# EAGLE design RevA (EAGLE 7.3.0)
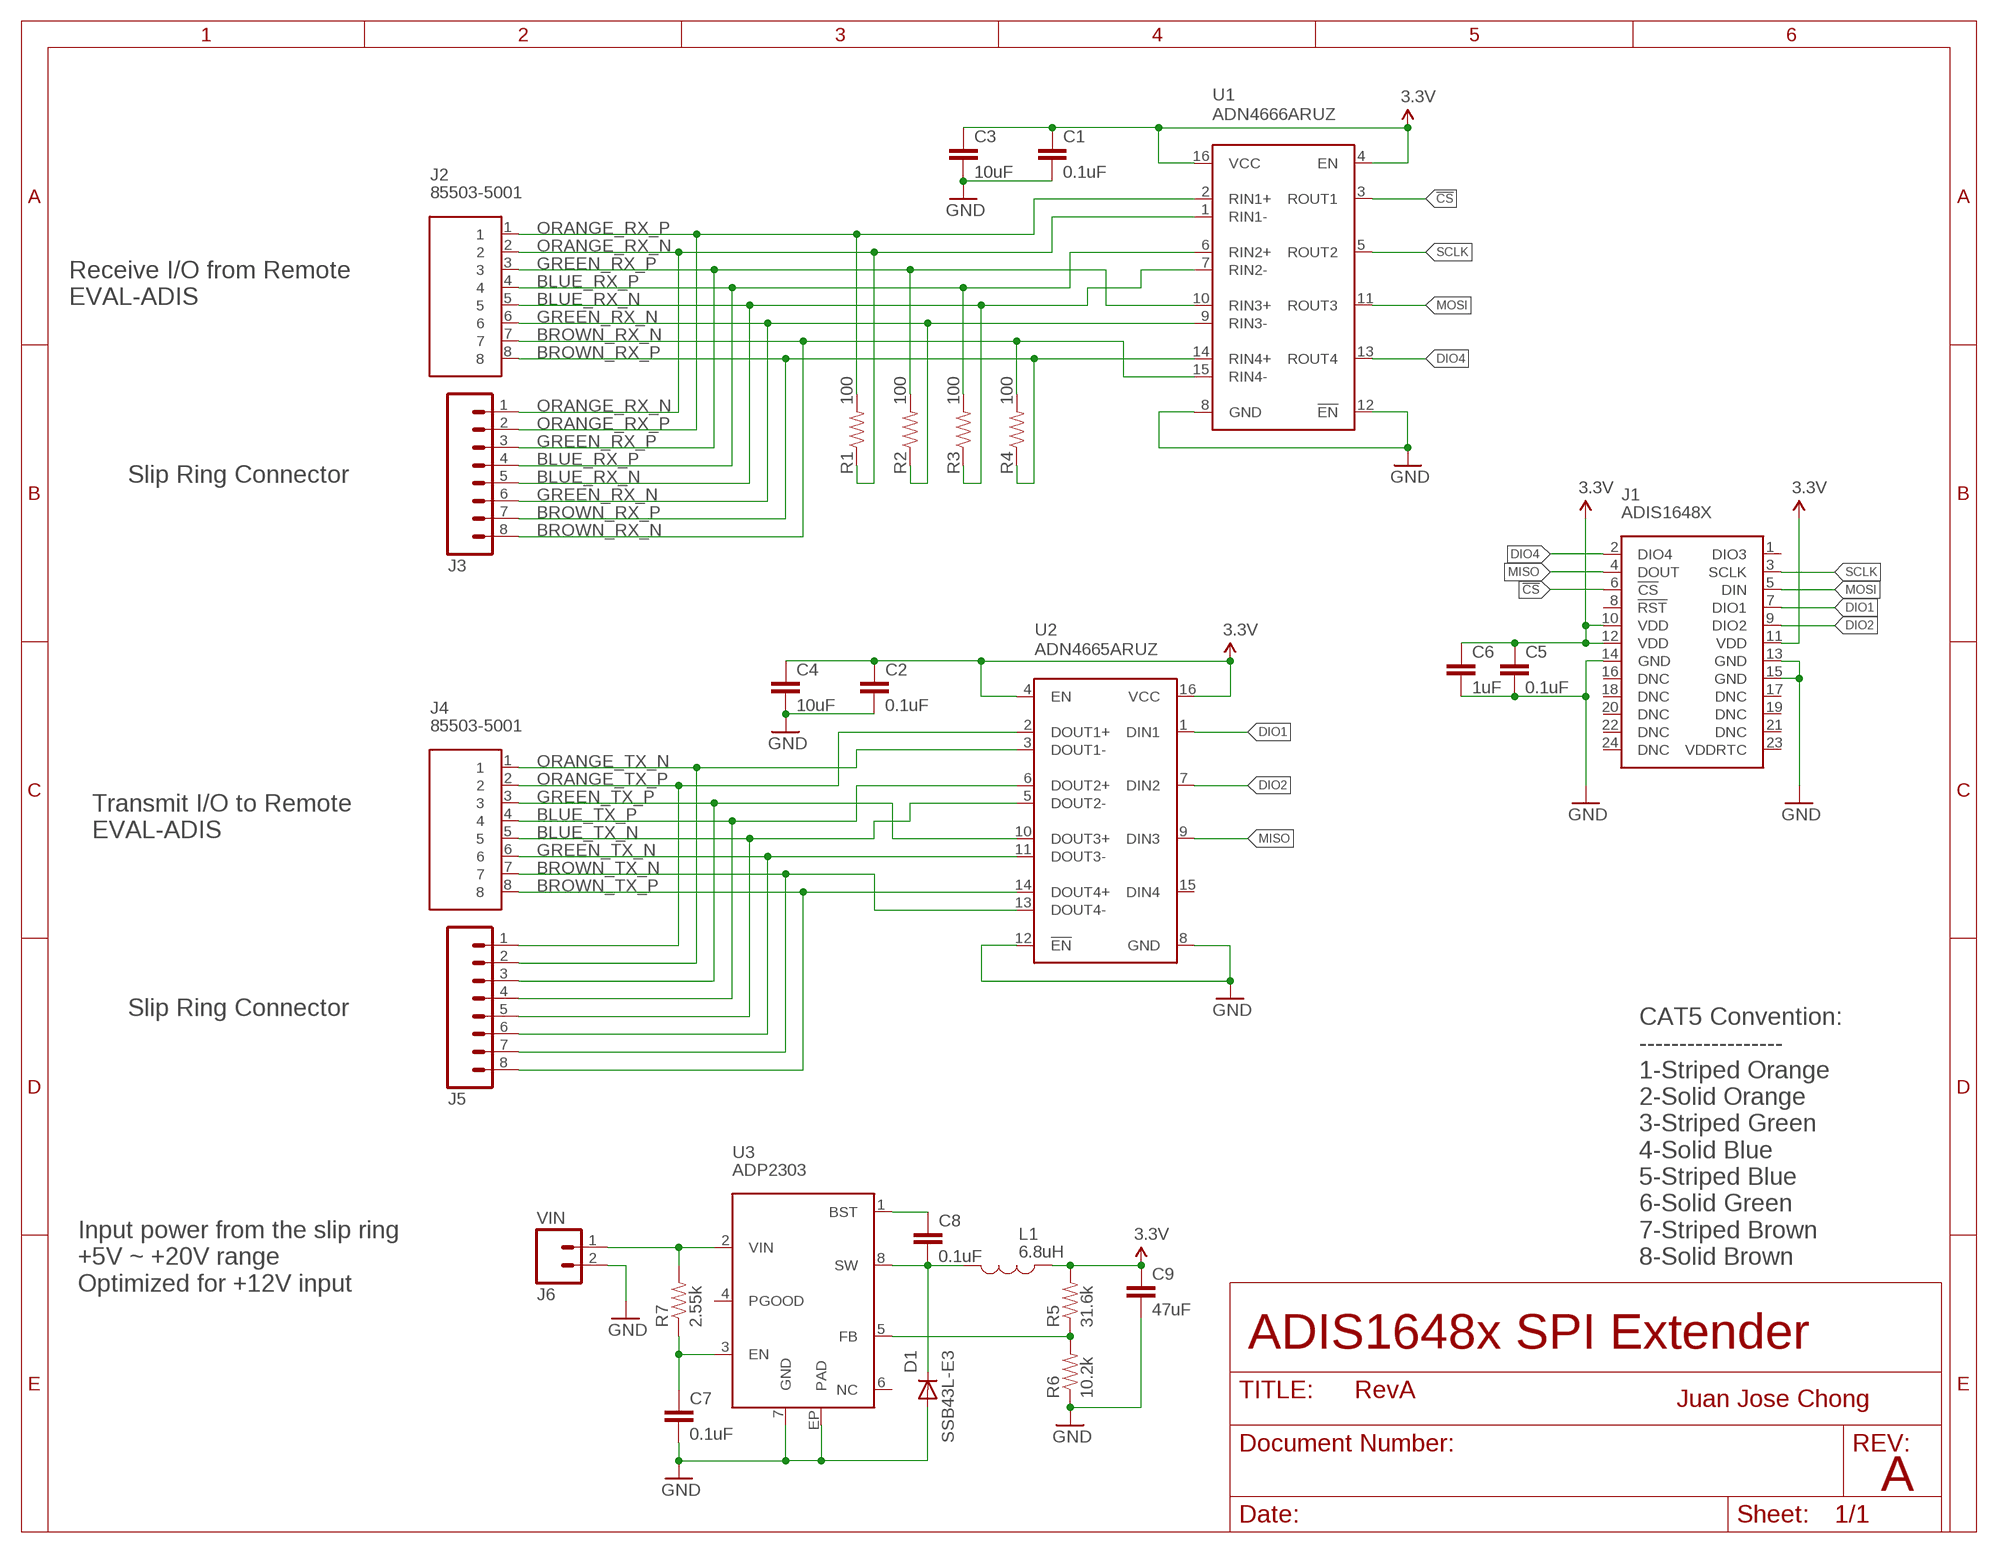
[diagram p0: schematic, sheet 1]

## Parts
C1  0.1uF  CAP0603-CAP  [0603-CAP]
C2  0.1uF  CAP0603-CAP  [0603-CAP]
C3  10uF  CAP1206  [1206]
C4  10uF  CAP1206  [1206]
C5  0.1uF  CAP0603-CAP  [0603-CAP]
C6  1uF  CAP0603-CAP  [0603-CAP]
C7  0.1uF  CAP0603-CAP  [0603-CAP]
C8  0.1uF  CAP0603-CAP  [0603-CAP]
C9  47uF  CAP1206  [1206]
D1  SSB43L-E3  DIODE-DO214AA  [DO214AA]
J1  ADIS1648X  [ADIS1648X]
J2  85503-5001  [85503-5001]
J3  M08LOCK  [1X08_LOCK]
J4  85503-5001  [85503-5001]
J5  M08LOCK  [1X08_LOCK]
J6  VIN  M023.5MM  [SCREWTERMINAL-3.5MM-2]
L1  6.8uH  INDUCTOR  [VLF10040]
R1  100  RESISTOR0603-RES  [0603-RES]
R2  100  RESISTOR0603-RES  [0603-RES]
R3  100  RESISTOR0603-RES  [0603-RES]
R4  100  RESISTOR0603-RES  [0603-RES]
R5  31.6k  RESISTOR0603-RES  [0603-RES]
R6  10.2k  RESISTOR0603-RES  [0603-RES]
R7  2.55k  RESISTOR0603-RES  [0603-RES]
U1  ADN4666ARUZ  [TSSOP-16]
U2  ADN4665ARUZ  [TSSOP-16]
U3  ADP2303  [SOIC-8-PAD]

## Nets
3.3V: C1.1 C2.1 C3.1 C4.1 C5.1 C6.1 C9.1 J1.10(VDD) J1.11(VDD) J1.12(VDD) L1.P$1 R5.2 U1.4(EN) U1.16(VCC) U2.4(EN) U2.16(VCC)
!CS: J1.6(!CS) U1.3(ROUT1)
BLUE_RX_N: J2.5 J3.5 R3.1 U1.7(RIN2-)
BLUE_RX_P: J2.4 J3.4 R3.2 U1.6(RIN2+)
BLUE_TX_N: J4.5 J5.5 U2.5(DOUT2-)
BLUE_TX_P: J4.4 J5.4 U2.6(DOUT2+)
BROWN_RX_N: J2.7 J3.8 R4.2 U1.15(RIN4-)
BROWN_RX_P: J2.8 J3.7 R4.1 U1.14(RIN4+)
BROWN_TX_N: J4.7 J5.7 U2.13(DOUT4-)
BROWN_TX_P: J4.8 J5.8 U2.14(DOUT4+)
DIO1: J1.7(DIO1) U2.1(DIN1)
DIO2: J1.9(DIO2) U2.7(DIN2)
DIO4: J1.2(DIO4) U1.13(ROUT4)
GND: C1.2 C2.2 C3.2 C4.2 C5.2 C6.2 C7.2 C9.2 D1.A J1.13(GND) J1.14(GND) J1.15(GND) J6.2 R6.1 U1.8(GND) U1.12(!EN) U2.8(GND) U2.12(!EN) U3.7(GND) U3.EP(PAD)
GREEN_RX_N: J2.6 J3.6 R2.1 U1.9(RIN3-)
GREEN_RX_P: J2.3 J3.3 R2.2 U1.10(RIN3+)
GREEN_TX_N: J4.6 J5.6 U2.11(DOUT3-)
GREEN_TX_P: J4.3 J5.3 U2.10(DOUT3+)
MISO: J1.4(DOUT) U2.9(DIN3)
MOSI: J1.5(DIN) U1.11(ROUT3)
N$1: J6.1 R7.2 U3.2(VIN)
N$2: R5.1 R6.2 U3.5(FB)
N$3: C8.2 D1.C L1.P$2 U3.8(SW)
N$4: C8.1 U3.1(BST)
N$5: C7.1 R7.1 U3.3(EN)
ORANGE_RX_N: J2.2 J3.1 R1.1 U1.1(RIN1-)
ORANGE_RX_P: J2.1 J3.2 R1.2 U1.2(RIN1+)
ORANGE_TX_N: J4.1 J5.2 U2.3(DOUT1-)
ORANGE_TX_P: J4.2 J5.1 U2.2(DOUT1+)
SCLK: J1.3(SCLK) U1.5(ROUT2)
Unconnected: J1.1(DIO3) J1.8(!RST) J1.16(DNC) J1.17(DNC) J1.18(DNC) J1.19(DNC) J1.20(DNC) J1.21(DNC) J1.22(DNC) J1.23(VDDRTC) J1.24(DNC) U2.15(DIN4) U3.4(PGOOD) U3.6(NC)

## Notes on the sheet
- Receive I/O from Remote
  EVAL-ADIS
- Slip Ring Connector
- Transmit I/O to Remote
  EVAL-ADIS
- Slip Ring Connector
- CAT5 Convention:
  ------------------
  1-Striped Orange
  2-Solid Orange
  3-Striped Green
  4-Solid Blue
  5-Striped Blue
  6-Solid Green
  7-Striped Brown
  8-Solid Brown
- Input power from the slip ring
  +5V ~ +20V range
  Optimized for +12V input
- ADIS1648x SPI Extender
- Juan Jose Chong
- A

## Library data of the parts
C1 C2 C5 C7 C8 = SparkFun-Passives:CAP: Capacitor Standard 0603 ceramic capacitor, and 0.1" leaded capacitor.; PARTNO: CL10B104KB8NNNC
C3 C4 = SparkFun-Passives:CAP: Capacitor Standard 0603 ceramic capacitor, and 0.1" leaded capacitor.; PARTNO: F931C106MAA
C6 = SparkFun-Passives:CAP: Capacitor Standard 0603 ceramic capacitor, and 0.1" leaded capacitor.; PARTNO: GRM188R61C105KA93D
C9 = SparkFun-Passives:CAP: Capacitor Standard 0603 ceramic capacitor, and 0.1" leaded capacitor.; PARTNO: TLJA476M010R0600
D1 = Chong:DIODE-: DIODE; PARTNO: SSB43L-E3/52T
J1 = Analog Devices iSensors:ADIS1648X
J2 J4 = AnalogDevices:85503-5001; PARTNO: 855035001
J3 J5 = SparkFun-Connectors:M08: Header 8 Standard 8-pin 0.1" header. Use with straight break away headers (SKU : PRT-00116), right angle break away headers (PRT-00553), swiss pins (PRT-00743), machine pins (PRT-00117), and female headers (PRT-00115).
J6 = SparkFun-Connectors:M02: Standard 2-pin 0.1" header. Use with - straight break away headers ( PRT-00116) - right angle break away headers (PRT-00553) - swiss pins (PRT-00743) - machine pins (PRT-00117) - female headers (PRT-00115) Molex polarized connector foot print use with: PRT-08233 with associated crimp pins and housings. 2.54_SCREWTERM for use with PRT-10571. 3.5mm Screw Terminal footprints for PRT-08084 5mm Screw Terminal footprints for use with PRT-08432
L1 = Chong:INDUCTOR: Inductors Basic Inductor/Choke - 0603 and 1206. Footprints are not proven and vary greatly between part numbers. SRN6045- 33uH, 20% 1.4A SDR0403-560KL - 56uH, 10%, 500mA RMS/740mA peak; PARTNO: VLF10040T-6R8N4R5
R1-R4 = SparkFun-Passives:RESISTOR: Resistor Basic schematic elements and footprints for 0603, 1206, and PTH resistors.; PARTNO: ERJ-3EKF1000V
R5 = SparkFun-Passives:RESISTOR: Resistor Basic schematic elements and footprints for 0603, 1206, and PTH resistors.; PARTNO: ERJ-3EKF3162V
R6 = SparkFun-Passives:RESISTOR: Resistor Basic schematic elements and footprints for 0603, 1206, and PTH resistors.; PARTNO: ERJ-3EKF1022V
R7 = SparkFun-Passives:RESISTOR: Resistor Basic schematic elements and footprints for 0603, 1206, and PTH resistors.
U1 = Analog Devices iSensors:ADN4666; PARTNO: ADN4666ARUZ
U2 = Analog Devices iSensors:ADN4665; PARTNO: ADN4665ARUZ
U3 = AnalogDevices:ADP2303; PARTNO: ADP2303ARDZ

## Board
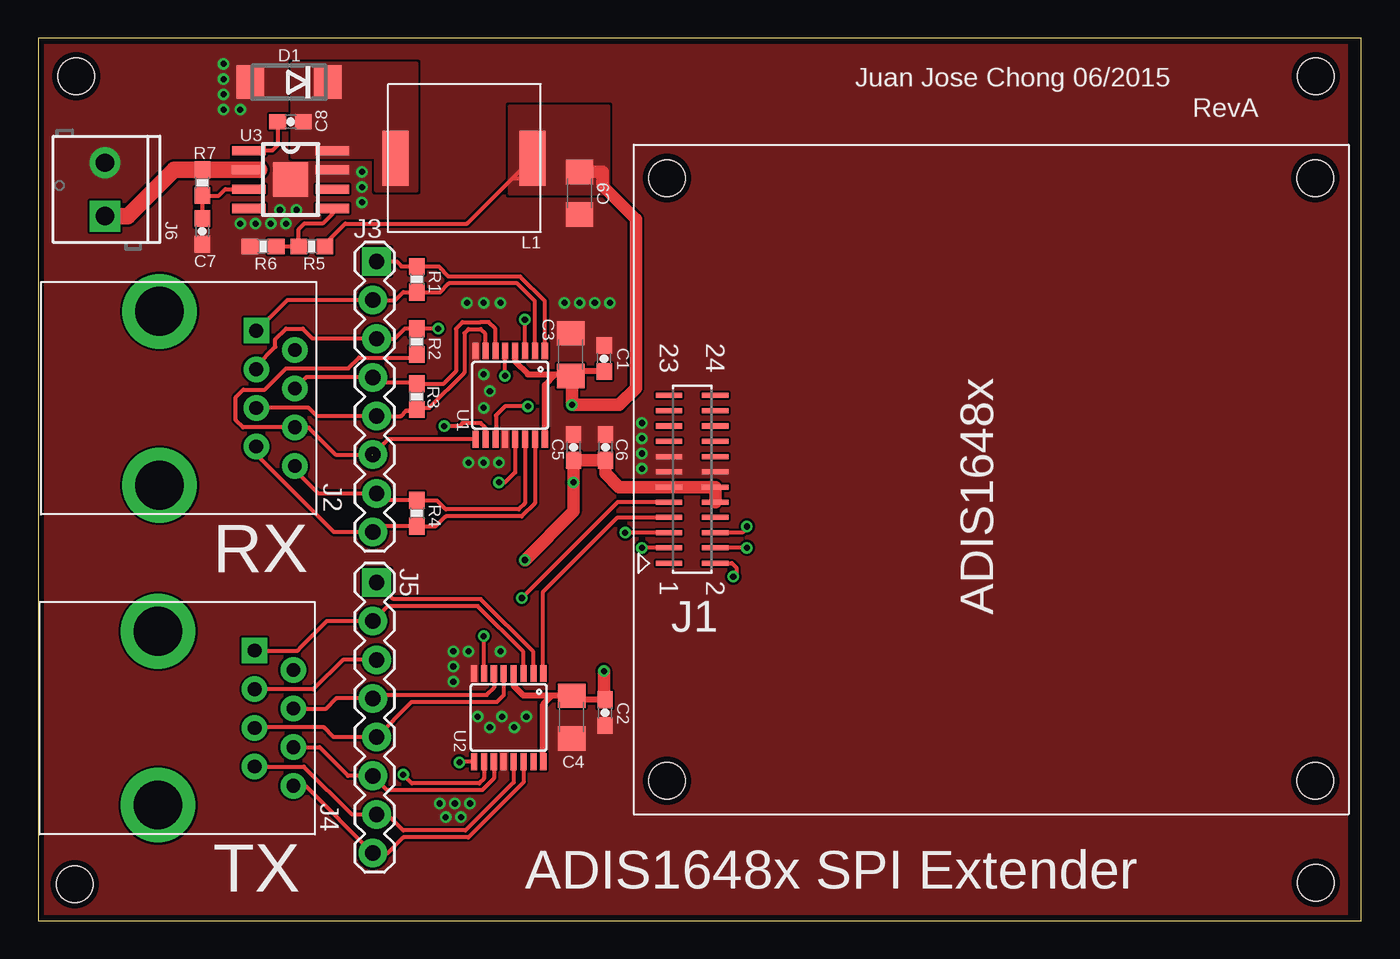
[diagram p1: board, top side]
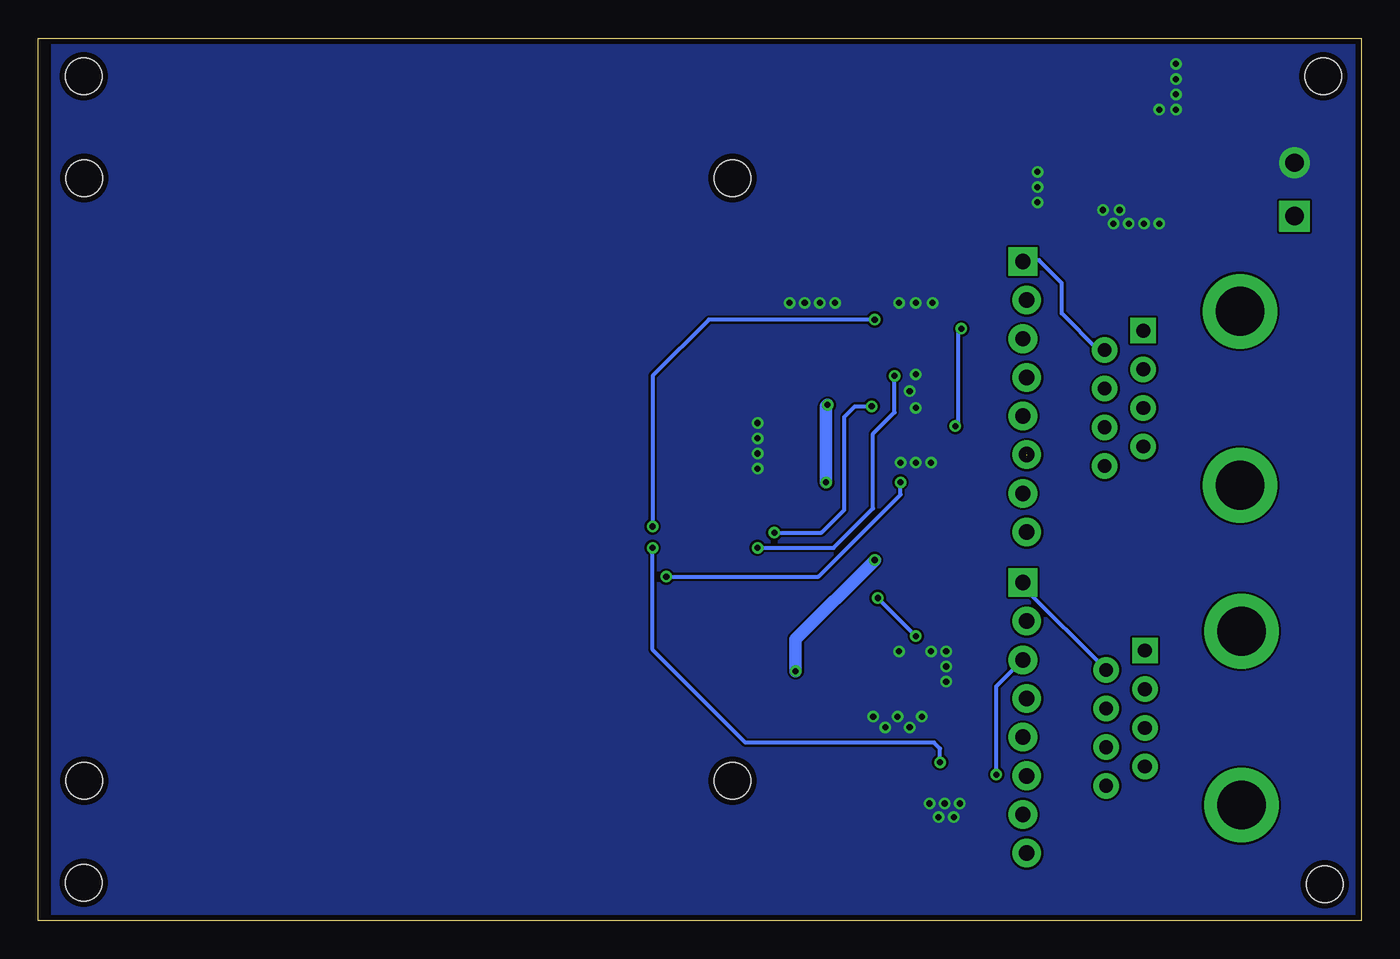
[diagram p2: board, bottom side, seen from below]

Size 87 x 58 mm. Coordinates in mm from the lower left corner, seen from the top.
Outline: 0,0 87,0 87,58 0,58 0,0
Copper layers (1*16): Top 0.0356mm / dielectric 1.5011mm / Bottom 0.0356mm
Design rules "LaenPCBOrder": minimum track width 6mil, minimum drill 13mil, track to track 6mil, track to pad 6mil, pad to pad 6mil, via to via 6mil, smd to smd 6mil, copper to edge 15mil, drill to drill 6mil, minimum pad ring 7mil, minimum via ring 7mil, stop-mask expansion 4mil, vias tented up to drill 0mil, thermal gap 10mil
Holes 2.4 mm at 2.5,55.5 2.4,2.4 84,2.5 84,55.5

### Footprints (pad centres in the part's own frame; a part is rotated, then mirrored left to right if it is on the bottom)
0603-CAP = smd 1.1 x 1: 1 -0.85,0; 2 0.85,0
1206 = smd 1.6 x 1.8: 1 -1.4,0; 2 1.4,0
DO214AA = smd 1.8 x 2.2: A 2.55,0; C -2.55,0
ADIS1648X = smd 0.33 x 1.727: 1 5.512,-1.524; 2 5.512,1.524; 3 4.496,-1.524; 4 4.496,1.524; 5 3.505,-1.524; 6 3.505,1.524; 7 2.489,-1.524; 8 2.489,1.524; 9 1.499,-1.524; 10 1.499,1.524; 11 0.508,-1.524; 12 0.508,1.524; 13 -0.508,-1.524; 14 -0.508,1.524; 15 -1.499,-1.524; 16 -1.499,1.524; 17 -2.489,-1.524; 18 -2.489,1.524; 19 -3.505,-1.524; 20 -3.505,1.524; 21 -4.496,-1.524; 22 -4.496,1.524; 23 -5.512,-1.524; 24 -5.512,1.524 | hole 2.4: -19.8,-1.642; 19.8,-1.642; 19.8,40.958; -19.8,40.958
85503-5001 = drill 0.9 pad 1.676 square: 1 0,0 | drill 0.9 pad 1.676: 2 1.27,2.54; 3 2.54,0; 4 3.81,2.54; 5 5.08,0; 6 6.35,2.54; 7 7.62,0; 8 8.89,2.54 | drill 3.2 pad 4.9: P$1 -1.27,-6.35; P$2 10.16,-6.35
1X08_LOCK = drill 1.016 pad 1.88 square: 1 0,0.127 | drill 1.016 pad 1.88: 2 2.54,-0.127; 3 5.08,0.127; 4 7.62,-0.127; 5 10.16,0.127; 6 12.7,-0.127; 7 15.24,0.127; 8 17.78,-0.127
SCREWTERMINAL-3.5MM-2 = drill 1.2 pad 2.032 square: 1 0,0 | drill 1.2 pad 2.032: 2 3.5,0
VLF10040 = smd 1.7 x 3.6: P$1 -4.5,0; P$2 4.5,0
0603-RES = smd 1.1 x 1: 1 -0.85,0; 2 0.85,0
TSSOP-16 = smd 0.4 x 1.1: 1 -2.275,-2.9; 2 -1.625,-2.9; 3 -0.975,-2.9; 4 -0.325,-2.9; 5 0.325,-2.9; 6 0.975,-2.9; 7 1.625,-2.9; 8 2.275,-2.9; 9 2.275,2.9; 10 1.625,2.9; 11 0.975,2.9; 12 0.325,2.9; 13 -0.325,2.9; 14 -0.975,2.9; 15 -1.625,2.9; 16 -2.275,2.9
SOIC-8-PAD = smd 0.6 x 2.2: 1 -1.905,-2.75; 2 -0.635,-2.75; 3 0.635,-2.75; 4 1.905,-2.75; 5 1.905,2.75; 6 0.635,2.75; 7 -0.635,2.75; 8 -1.905,2.75 | smd 2.29 x 2.29: EP 0,0

### Placement (x,y rotation side)
C1  37.22,36.94 90 top
C2  37.28,13.67 270 top
C3  35.02,37.2 90 top
C4  35.08,13.38 270 top
C5  35.2,31.1 90 top
C6  37.3,31.1 90 top
C7  10.8,45.3 270 top
C8  16.6,52.5 0 top
C9  35.6,47.8 270 top
D1  16.5,55.1 180 top
J1  43,29 270 top
J2  14.34,38.77 270 top
J3  22.13,43.32 270 top
J4  14.24,17.75 270 top
J5  22.13,22.22 270 top
J6  4.4,46.3 90 top
L1  28,50.1 180 top
R1  24.9,42.14 270 top
R2  24.9,38.05 90 top
R3  24.9,34.44 90 top
R4  24.9,26.77 270 top
R5  18,44.3 0 top
R6  14.8,44.3 0 top
R7  10.8,48.5 90 top
U1  31.04,34.53 180 top
U2  30.94,13.35 180 top
U3  16.6,48.7 270 top

### Tracks (layer width: path | path; a pad name or v marks a point on that pad's centre or on a via)
3.3V  (via drill 0.4)
  Top 0.254: R5.2 19,44.6 20.2,45.8 28.2,45.8 31.2,48.8 | 31.2,48.8 L1.P$1 | 31.2,48.8 31.8,48.8
  Top 0.406: U2.16 33.22,14.21 33.8,14.8 | 33.8,14.8 35.06,14.8 C4.1 35.31,14.55 37.25,14.55 C2.1 | U2.4 31.27,15.44 31.9,14.8 33.8,14.8 | C1.1 35.31,36.09 C3.1 34.92,35.9 34,35.9 | U1.4 31.36,36.73 32.2,35.9 34,35.9 | U1.16 33.31,35.22 34,35.9
  Top 0.813: J1.10 J1.12 J1.11 38.21,28.49 37.3,29.4 C6.1 C5.1 v35.2,28.8 35.2,26.9 v32,23.7 | C3.1 35.1,35.72 v35.1,33.9 38.2,33.9 39.3,35 39.3,46.1 37.1,48.3 37.1,49.2 C9.1 | v37.2,16.4 37.2,14.6 C2.1
  Bottom 0.813: v35.2,28.8 35.2,33.8 v35.1,33.9 | v32,23.7 37.2,18.5 v37.2,16.4
  pour Top (no thermals): 31,53.5 31,47.8 37.5,47.8 37.5,53.5
!CS  (via drill 0.4)
  Top 0.254: U1.3 32.02,39.48 v32,39.5 | v46.6,25.9 46.6,25.8 46.3,25.5 J1.6
  Bottom 0.254: v32,39.5 42.9,39.5 46.6,35.8 v46.6,25.9
BLUE_RX_N
  Top 0.254: J2.5 17.8,33.7 18.34,33.16 J3.5 23.86,33.16 24.2,33.5 | 24.81,33.5 R3.1 | U1.7 29.41,38.56 29.1,38.87 28.3,38.87 28.03,38.6 28.03,36.01 25.72,33.7 24.89,33.7
  Top 0.305: J2.5 | 24.89,33.7 R3.1 | 24.2,33.5 24.81,33.5
BLUE_RX_P
  Top 0.254: J2.4 17.62,35.7 J3.4 22.31,35.39 24.8,35.39 | U1.6 30.07,38.9 29.63,39.33 29.1,39.33 27.91,39.33 27.47,38.9 27.47,36.09 26.67,35.29 R3.2
  Top 0.305: 24.8,35.39 R3.2
BLUE_TX_N
  Top 0.254: U2.5 30.61,14.81 30.17,14.37 24.57,14.37 J5.5 19.44,12.06 18.8,12.7 14.27,12.7 J4.5
BLUE_TX_P
  Top 0.254: U2.6 29.96,15.29 29.5,14.83 22.23,14.83 J5.4 19.6,14.6 18.9,13.9 16.82,13.9 J4.4
BROWN_RX_N
  Top 0.254: J2.7 14.34,30.66 19.46,25.54 J3.8 22.38,25.92 R4.2 26.15,25.92 26.8,26.57 31.8,26.57 32.66,27.44 U1.15
BROWN_RX_P
  Top 0.254: J2.8 16.88,29.62 18.4,28.1 22.24,28.1 J3.7 22.72,27.62 R4.1 26.21,27.62 26.8,27.03 31.61,27.03 32.02,27.44 U1.14
BROWN_TX_N
  Top 0.254: U2.13 31.27,9.09 28.11,5.93 24,5.93 22.95,6.98 J5.7 22.24,7 20.6,7 17.47,10.13 J4.7
BROWN_TX_P
  Top 0.254: U2.14 31.91,9.09 28.3,5.47 24,5.47 22.97,4.44 J5.8 17.58,8.86 J4.8
DIO1
  Top 0.254: U2.1 33.22,21.61 38.1,26.5 41.47,26.5 J1.7
DIO2  (via drill 0.4)
  Top 0.254: J1.9 38.1,27.5 v31.8,21.2 | v29.3,18.7 29.3,16.27 U2.7
  Bottom 0.254: v31.8,21.2 v29.3,18.7
DIO4  (via drill 0.4)
  Top 0.254: J1.2 45.61,23.49 45.9,23.2 45.9,22.8 v45.7,22.6 | v30.3,28.8 30.7,28.8 31.36,29.46 U1.13
  Bottom 0.254: v45.7,22.6 35.7,22.6 30.3,28 v30.3,28.8
GND  (via drill 0.4)
  other vias: 29.3,35.9 29.7,34.8 29.3,33.7 30.3,30.1 29.3,30.1 28.3,30.1 39.7,32.7 39.7,31.7 39.7,30.7 39.7,29.7 32.1,13.4 31.3,12.7 30.5,13.4 29.7,12.7 28.9,13.4 28.4,7.7 27.4,7.7 26.4,7.7 27.8,6.8 26.8,6.8 28.3,17.7 27.3,17.7 27.3,16.7 27.3,15.7 15.9,46.7 17,46.7 16.3,45.8 15.3,45.8 14.3,45.8 13.3,45.8 30.4,40.6 29.3,40.6 28.2,40.6 30.4,17.7 12.2,56.3 12.2,55.3 12.2,54.3 12.2,53.3 13.3,53.3 21.3,49.2 21.3,48.2 21.3,47.2 34.6,40.6 35.6,40.6 36.6,40.6 37.6,40.6
  pour Top (rank 6, no thermals): 0,0 86,0 86,58 0,58
  pour Bottom (rank 6, no thermals): 0,0 86,0 86,58 0,58
GREEN_RX_N  (1 unrouted)
  Top 0.254: R2.1 24.7,37 21.1,37 20.4,36.3 16.3,36.3 14.9,34.9 13.5,34.9 13,34.4 13,32.9 13.48,32.42 J2.6 16.9,32.4 17.8,32.4 19.6,30.6 22,30.6 | U1.9 23.01,31.63 J3.6
GREEN_RX_P  (via drill 0.4)
  Top 0.254: U1.10 29.41,32.38 29.1,32.7 27.9,32.7 27.7,32.5 v26.7,32.5 | v26.3,38.9 R2.2 24.1,38.9 23.44,38.24 J3.3 18.06,38.24 17.4,38.9 16.3,38.9 15.6,38.2 15.6,37.7 14.37,36.47 14.37,36.2 J2.3
  Bottom 0.254: v26.7,32.5 26.5,32.7 26.5,38.7 v26.3,38.9
GREEN_TX_N
  Top 0.254: U2.11 29.96,9.34 29.2,8.57 22.95,8.57 J5.6 20.38,9.52 18.5,11.4 J4.6
GREEN_TX_P  (via drill 0.4)
  Top 0.254: U2.10 29.32,9.34 29,9.03 24.57,9.03 v24,9.6 | J5.3 20.04,17.14 18.1,15.2 J4.3
  Bottom 0.254: v24,9.6 24,15.4 J5.3
MISO  (via drill 0.4)
  Top 0.254: U2.9 27.75,10.45 v27.7,10.4 | v46.6,24.5 J1.4
  Bottom 0.254: v27.7,10.4 27.7,11.3 28.1,11.7 40.5,11.7 46.6,17.8 v46.6,24.5
MOSI  (via drill 0.4)
  Top 0.254: J1.5 v38.6,25.5 | v32.2,33.8 30.7,33.8 30.1,33.2 30.1,31.66 U1.11
  Bottom 0.254: v38.6,25.5 35.5,25.5 34,27 34,33.1 33.3,33.8 v32.2,33.8
N$1
  Top 0.254: 14.52,49.35 13.87,49.35 U3.2
  Top 1.1: J6.1 5.9,46.3 8.94,49.34 R7.2 14.52,49.35
N$2
  Top 0.254: R6.2 R5.1 17.1,44.65 17.1,45.4 17.5,45.8 18.7,45.8 19.35,46.45 U3.5
N$3
  pour Top (no thermals): 16.7,56.3 16.7,50.2 22.2,50.2 22.2,48 24.9,48 24.9,56.3
N$4
  Top 0.254: C8.1 15.75,50.95 15.4,50.6 U3.1
N$5
  Top 0.254: U3.3 12.31,48.07 11.89,47.65 R7.1 C7.1
ORANGE_RX_N
  Top 0.254: J3.1 23.58,43.32 23.9,43 R1.1 26.34,42.99 27,42.33 31.7,42.33 33.31,40.71 U1.1
  Bottom 0.254: J2.2 17.3,37.5 19.7,39.9 19.7,41.9 21.2,43.4 22.18,43.4 J3.1
ORANGE_RX_P
  Top 0.254: J2.1 14.37,38.77 16.4,40.8 21.98,40.8 J3.2 23.48,40.78 24,41.3 R1.2 26.42,41.29 27,41.87 31.5,41.87 32.66,40.71 U1.2
ORANGE_TX_N
  Top 0.254: U2.3 31.91,17.66 28.91,20.67 22.99,20.67 J5.2 18.98,19.68 17.4,18.1 17.3,18 17.05,17.75 J4.1
ORANGE_TX_P
  Top 0.254: U2.2 32.56,17.66 29.09,21.13 23.35,21.13 J5.1
  Bottom 0.254: J5.1 22.26,21.96 J4.2
SCLK  (via drill 0.4)
  Top 0.254: J1.3 v39.7,24.5 | v30.7,35.8 30.7,37.41 U1.5
  Bottom 0.254: v39.7,24.5 34.7,24.5 32.1,27.1 32.1,32 30.7,33.4 v30.7,35.8

### Text on the board
tNames: Juan Jose Chong 06/2015 | RevA | RX | ADIS1648x | TX | ADIS1648x SPI Extender